# Altium project Keyboard.PrjPcb
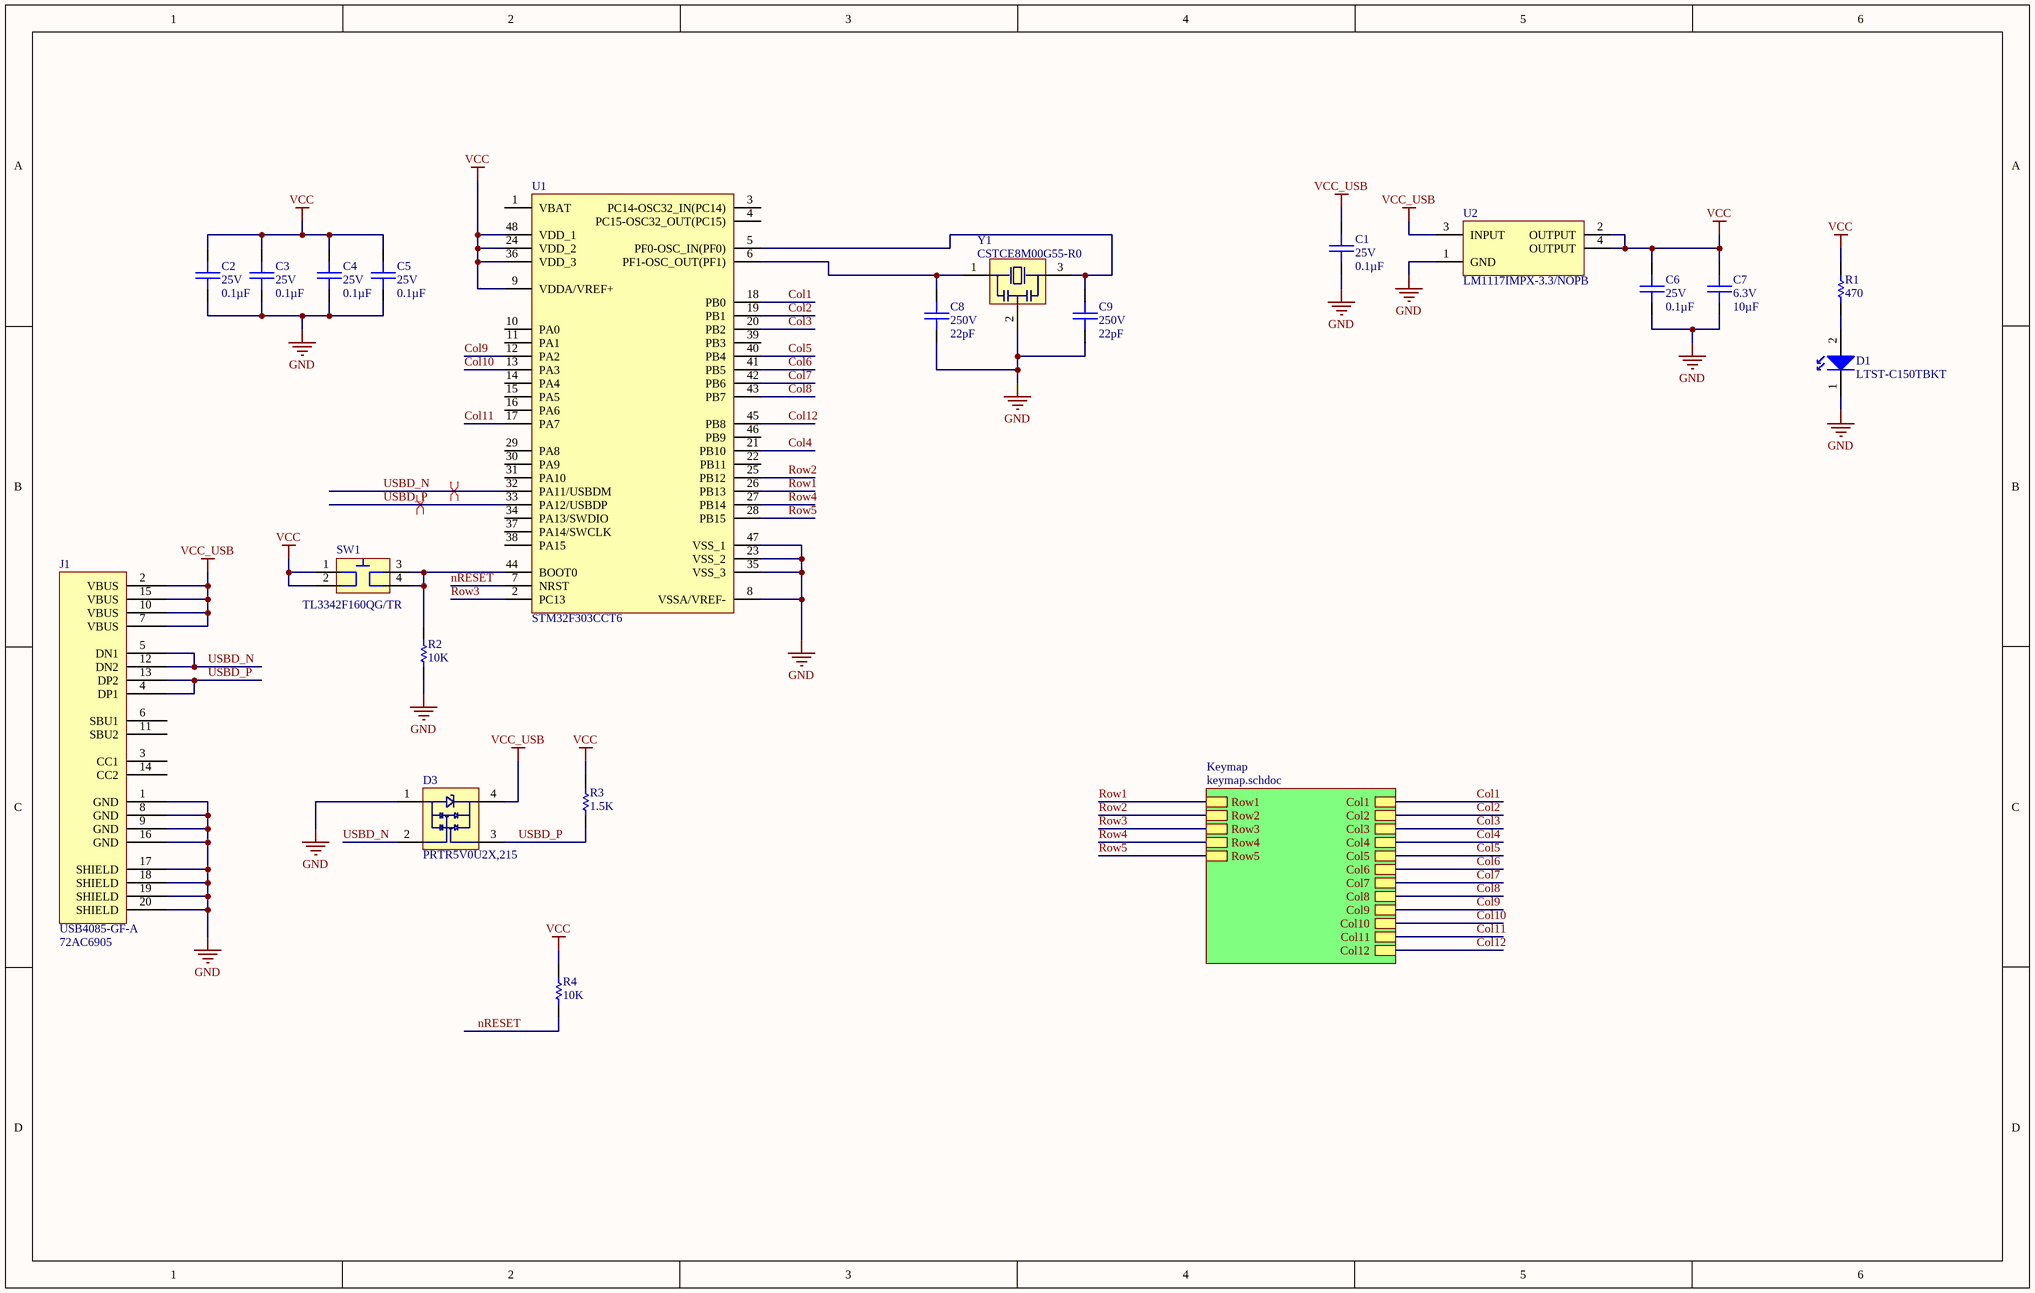
[diagram p0: Sheet1.SchDoc]
3 sheets, 140 parts. Net scope: hierarchical (ports join the sheet entries above them; power ports are global).
Board file: PCB1.PcbDoc
Sheets:
  Sheet1.SchDoc
    Keymap = Keymap.SchDoc
      K1 = key.SchDoc
      K2 = key.SchDoc
      K3 = key.SchDoc
      K4 = key.SchDoc
      K5 = key.SchDoc
      K6 = key.SchDoc
      K7 = key.SchDoc
      K8 = key.SchDoc
      K9 = key.SchDoc
      K10 = key.SchDoc
      K11 = key.SchDoc
      K12 = key.SchDoc
      K13 = key.SchDoc
      K14 = key.SchDoc
      K15 = key.SchDoc
      K16 = key.SchDoc
      K17 = key.SchDoc
      K18 = key.SchDoc
      K19 = key.SchDoc
      K20 = key.SchDoc
      K21 = key.SchDoc
      K22 = key.SchDoc
      K23 = key.SchDoc
      K24 = key.SchDoc
      K25 = key.SchDoc
      K26 = key.SchDoc
      K27 = key.SchDoc
      K28 = key.SchDoc
      K29 = key.SchDoc
      K30 = key.SchDoc
      K31 = key.SchDoc
      K32 = key.SchDoc
      K33 = key.SchDoc
      K34 = key.SchDoc
      K35 = key.SchDoc
      K36 = key.SchDoc
      K37 = key.SchDoc
      K38 = key.SchDoc
      K39 = key.SchDoc
      K40 = key.SchDoc
      K41 = key.SchDoc
      K42 = key.SchDoc
      K43 = key.SchDoc
      K44 = key.SchDoc
      K45 = key.SchDoc
      K46 = key.SchDoc
      K47 = key.SchDoc
      K48 = key.SchDoc
      K49 = key.SchDoc
      K50 = key.SchDoc
      K51 = key.SchDoc
      K52 = key.SchDoc
      K53 = key.SchDoc
      K54 = key.SchDoc
      K55 = key.SchDoc
      K56 = key.SchDoc
      K57 = key.SchDoc
      K58 = key.SchDoc
      K59 = key.SchDoc
      K60 = key.SchDoc

## Sheet Sheet1.SchDoc
size B; DocumentNumber: 1; SheetNumber: 1; SheetTotal: 3

### Parts
C1  value 0.1µF  Voltage: 25V  [CAPC_0603(1.6X0.8)_N]  (hidden comment: Generic CAPC 0603 0.1µF 25V ±10% X7R)
C2  value 0.1µF  Voltage: 25V  [CAPC_0603(1.6X0.8)_N]  (hidden comment: Generic CAPC 0603 0.1µF 25V ±10% X7R)
C3  value 0.1µF  Voltage: 25V  [CAPC_0603(1.6X0.8)_N]  (hidden comment: Generic CAPC 0603 0.1µF 25V ±10% X7R)
C4  value 0.1µF  Voltage: 25V  [CAPC_0603(1.6X0.8)_N]  (hidden comment: Generic CAPC 0603 0.1µF 25V ±10% X7R)
C5  value 0.1µF  Voltage: 25V  [CAPC_0603(1.6X0.8)_N]  (hidden comment: Generic CAPC 0603 0.1µF 25V ±10% X7R)
C6  value 0.1µF  Voltage: 25V  [CAPC_0603(1.6X0.8)_N]  (hidden comment: Generic CAPC 0603 0.1µF 25V ±10% X7R)
C7  value 10µF  Voltage: 6.3V  [CAPC_0603(1.6X0.8)_N]  (hidden comment: Generic CAPC 0603 10µF 6.3V ±20% X5R)
C8  value 22pF  Voltage: 250V  [CAPC_0603(1.6X0.8)_N]  (hidden comment: Generic CAPC 0603 22pF 250V ±2% C0G/NP0)
C9  value 22pF  Voltage: 250V  [CAPC_0603(1.6X0.8)_N]  (hidden comment: Generic CAPC 0603 22pF 250V ±2% C0G/NP0)
D1  LED 468NM BLUE CLEAR 1206 SMD  [LTST-C150TBKT_N]  (value not drawn)
D3  TVS DIODE 5.5VWM SOT143B  [NXP_SOT143B_N]  (value not drawn)
J1  USB4085-GF-A  Supplier Part Number 1: 72AC6905  [GCT_USB4085-GF-A_MN]
R1  value 470  [RESC_0603(1.6X0.8)_N]  (hidden comment: Generic RES 0603 470 0.1W 5%)
R2  value 10K  [RESC_0603(1.6X0.8)_N]  (hidden comment: Generic RES 0603 10K 0.1W 5%)
R3  value 1.5K  [RESC_0603(1.6X0.8)_N]  (hidden comment: Generic RES 0603 1.5K 0.1W 5%)
R4  value 10K  [RESC_0603(1.6X0.8)_N]  (hidden comment: Generic RES 0603 10K 0.1W 5%)
SW1  Manufacturer Part Number: TL3342F160QG/TR  [TL3342F160QG-TR]  (hidden comment: SWITCH TACTILE SPST-NO 0.05A 12V)
U1  32BIT, CORTEX-M4, 72MHZ, LQFP-48  [ST_LQFP-48-7x7x1.4_MN]  (value not drawn)
U2  Manufacturer Part Number: LM1117IMPX-3.3/NOPB  [TI_DCY-R-PDSO-G4_N]  (hidden comment: IC REG LDO 3.3V 0.8A SOT223)
Y1  CER RESONATOR 8.00MHZ SMD  [CSTCE8M00G55-R0]  (value not drawn)

### Sub-sheets
Keymap = keymap.schdoc: Col3, Col7, Col10, Col1, Col9, Col11, Row5, Col2, Col4, Col12, Col5, Col6, Row1, Row3, Row2, Row4, Col8

### Nets
GND: C1.2 C2.2 C3.2 C4.2 C5.2 C6.2 C7.2 C8.2 C9.2 D1.1(K) D3.1(GND) J1.1(GND) J1.8(GND) J1.9(GND) J1.16(GND) J1.17(SHIELD) J1.18(SHIELD) J1.19(SHIELD) J1.20(SHIELD) R2.1 U1.8(VSSA/VREF-) U1.23(VSS_2) U1.35(VSS_3) U1.47(VSS_1) U2.1(GND) Y1.2
VCC: C2.1 C3.1 C4.1 C5.1 C6.1 C7.1 R1.2 R3.2 R4.2 SW1.1 SW1.2 U1.9(VDDA/VREF+) U1.24(VDD_2) U1.36(VDD_3) U1.48(VDD_1) U2.2(OUTPUT) U2.4(OUTPUT)
VCC_USB: C1.1 D3.4(VCC) J1.2(VBUS) J1.7(VBUS) J1.10(VBUS) J1.15(VBUS) U2.3(INPUT)
Col1: U1.18(PB0) ; sheet Keymap/Col1
Col2: U1.19(PB1) ; sheet Keymap/Col2
Col3: U1.20(PB2) ; sheet Keymap/Col3
Col4: U1.21(PB10) ; sheet Keymap/Col4
Col5: U1.40(PB4) ; sheet Keymap/Col5
Col6: U1.41(PB5) ; sheet Keymap/Col6
Col7: U1.42(PB6) ; sheet Keymap/Col7
Col8: U1.43(PB7) ; sheet Keymap/Col8
Col9: U1.12(PA2) ; sheet Keymap/Col9
Col10: U1.13(PA3) ; sheet Keymap/Col10
Col11: U1.17(PA7) ; sheet Keymap/Col11
Col12: U1.45(PB8) ; sheet Keymap/Col12
nRESET: R4.1 U1.7(NRST)
Row1: U1.26(PB13) ; sheet Keymap/Row1
Row2: U1.25(PB12) ; sheet Keymap/Row2
Row3: U1.2(PC13) ; sheet Keymap/Row3
Row4: U1.27(PB14) ; sheet Keymap/Row4
Row5: U1.28(PB15) ; sheet Keymap/Row5
USBD_N: D3.2(IO1) J1.5(DN1) J1.12(DN2) U1.32(PA11/USBDM)
USBD_P: D3.3(IO2) J1.4(DP1) J1.13(DP2) R3.1 U1.33(PA12/USBDP)
NetC8_1: C8.1 U1.6(PF1-OSC_OUT(PF1)) Y1.1
NetC9_1: C9.1 U1.5(PF0-OSC_IN(PF0)) Y1.3
NetD1_2: D1.2(A) R1.1
NetR2_2: R2.2 SW1.3 SW1.4 U1.44(BOOT0)

Not connected (* = marked no-connect by the designer): J1 3(CC1) 6(SBU1) 11(SBU2) 14(CC2); U1 1(VBAT) 3(PC14-OSC32_IN(PC14)) 4(PC15-OSC32_OUT(PC15)) 10(PA0) 11(PA1) 14(PA4) 15(PA5) 16(PA6) 22(PB11) 29(PA8) 30(PA9) 31(PA10) 34(PA13/SWDIO) 37(PA14/SWCLK) 38(PA15) 39(PB3) 46(PB9)

### Layout directives
differential pair: USBD_N, USBD_P

### Library data of the parts
C1-C6 = SFE-CAPC-0603-0.1µF-25V-±10%-X7R: Generic Capacitor; Case-IEC: 0603; capacitance: 0.0000001; Case-Metric: *; Tolerance: ±10%; DesignID: SFE-CAPC-0603-0.1µF-25V-±10%-X7R; Manufacturer: Generic; Manufacturer Part Number: SFE-CAPC-0603-0.1µF-25V-±10%-X7R
C7 = SFE-CAPC-0603-10µF-6.3V-±20%-X5R: Generic Capacitor; Case-IEC: 0603; capacitance: 0.00001; Case-Metric: *; Tolerance: ±20%; DesignID: SFE-CAPC-0603-10µF-6.3V-±20%-X5R; Manufacturer: Generic; Manufacturer Part Number: SFE-CAPC-0603-10µF-6.3V-±20%-X5R
C8 C9 = SFE-CAPC-0603-22pF-250V-±2%-C0G/NP0: Generic Capacitor; Case-IEC: 0603; capacitance: 0.000000000022; Case-Metric: *; Tolerance: ±2%; DesignID: SFE-CAPC-0603-22pF-250V-±2%-C0G/NP0; Manufacturer: Generic; Manufacturer Part Number: SFE-CAPC-0603-22pF-250V-±2%-C0G/NP0
D1 = LTST-C150TBKT: Manufacturer: Lite-On Inc; SafariPartNumber: 15 25012RC; Wavelength - Dominant: 470nm; Millicandela Rating: 104mcd; Voltage - Forward (Vf) (Typ): 3.3V; Current - Test: 20mA; Viewing Angle: 130°; Lens Style/Size: Rectangle with Flat Top, 2.06mm x 1.6mm; Supplier 1: Digi-Key; Supplier Part Number 1: 160-1643-1-ND; RoHS: RoHS Compliant; Category: Optoelectronics; Stock 1: 267579; Pricing 1: 1=0.5, 10=0.369, 100=0.1956, 250=0.13836, 500=0.11808, 1000=0.09225 (USD); Packaging: Cut Tape (CT); Color: Blue; Wavelength - Peak: 468nm; Lens Type: Clear; Package / Case: 1206 (3216 Metric); Size / Dimension: 3.20mm L x 1.60mm W; Height: 1.10mm; Mounting Type: Surface Mount; Luminous Flux @ Current - Test: -; ComponentLink1URL: http://optoelectronics.liteon.com/upload/download/DS22-2000-026/S_110_LTST-C150TBKT(0630).pdf; ComponentLink1Description: http://optoelectronics.liteon.com/upload/download/DS22-2000-026/S_110_LTST-C150TBKT(0630).pdf; Manufacturer Part Number: LTST-C150TBKT; DesignID: LTST-C150TBKT
D3 = PRTR5V0U2X,215: Manufacturer: NXP Semiconductors; SafariPartNumber: 15 27314RC; Type: Steering (Rail to Rail); Bidirectional Channels: 2; Voltage - Reverse Standoff (Typ): 5.5V (Max); Voltage - Breakdown (Min): 6V; Power Line Protection: Yes; Capacitance @ Frequency: 1pF @ 1MHz; Supplier 1: Digi-Key; Supplier Part Number 1: 568-4140-1-ND; RoHS: RoHS Compliant; Category: Circuit Protection; Stock 1: 19762; Pricing 1: 1=0.57, 10=0.477, 25=0.418, 100=0.3578, 250=0.31036, 500=0.26286, 1000=0.20265 (USD); Packaging: Cut Tape (CT); Unidirectional Channels: -; Voltage - Clamping (Max) @ Ipp: -; Current - Peak Pulse (10/1000µs): -; Power - Peak Pulse: -; Applications: General Purpose; Operating Temperature: -40°C ~ 85°C (TA); Mounting Type: Surface Mount; Package / Case: TO-253-4, TO-253AA; Supplier Device Package: SOT-143B; ComponentLink1URL: https://assets.nexperia.com/documents/data-sheet/PRTR5V0U2X.pdf; ComponentLink1Description: Datasheet; Manufacturer Part Number: PRTR5V0U2X,215; DesignID: PRTR5V0U2X,215
J1 = USB4085-GF-A: USB4085 Series 20 V PCB Top Mount USB 2.0 Type C Receptacle; Manufacturer 1: Global Connector Technology; USB Standard: USB 2.0; Number of Positions: 16; Supplier 1: Newark; Manufacturer Part Number 1: USB4085-GF-A; RoHS: No; Pricing 1: 1=1.38000, 10=1.23000, 25=1.15000, 50=1.06000, 100=0.91100, 250=0.83700, 700=0.77300, 1400=0.72600 (USD); Contact Material: Copper Alloy; Contact Plating: Gold; Gender: Receptacle; Orientation: Right Angle; ComponentLink1URL: https://datasheet.ciiva.com/71788/2674755-71788146.pdf?src-supplier=Element14; ComponentLink1Description: https://datasheet.ciiva.com/71788/2674755-71788146.pdf?src-supplier=Element14; ComponentLink2URL: https://datasheet.ciiva.com/71788/usb4085-71788147.pdf?src-supplier=Digi-Key; ComponentLink2Description: https://datasheet.ciiva.com/71788/usb4085-71788147.pdf?src-supplier=Digi-Key
R1 = SFE-RES-0603-470-0.1W-5%: Generic Resistor; Temperature Coefficient: PPM; Case-IEC: 0603; ValueString: 4705%; Tolerance: 5%; Power: 0.1W; DesignID: SFE-RES-0603-470-0.1W-5%; Manufacturer: Generic; Manufacturer Part Number: SFE-RES-0603-470-0.1W-5%; Resistance: 470
R2 R4 = SFE-RES-0603-10K-0.1W-5%: Generic Resistor; Temperature Coefficient: PPM; Case-IEC: 0603; ValueString: 10K5%; Resistance: 10000; Tolerance: 5%; Power: 0.1W; DesignID: SFE-RES-0603-10K-0.1W-5%; Manufacturer: Generic; Manufacturer Part Number: SFE-RES-0603-10K-0.1W-5%
R3 = SFE-RES-0603-1.5K-0.1W-5%: Generic Resistor; Temperature Coefficient: PPM; Case-IEC: 0603; ValueString: 1.5K5%; Resistance: 1500; Tolerance: 5%; Power: 0.1W; DesignID: SFE-RES-0603-1.5K-0.1W-5%; Manufacturer: Generic; Manufacturer Part Number: SFE-RES-0603-1.5K-0.1W-5%
SW1 = TL3342F160QG/TR: Manufacturer: E-Switch; Switch Function: Off-Mom; Contact Rating @ Voltage: 0.05A @ 12VDC; Actuator Type: Standard; Actuator Height off PCB, from Pins: 1.54mm; Actuator Orientation: Top Actuated; Outline: 4.90mm x 4.90mm; Illumination: Non-Illuminated; Operating Force: 160gf; Actuator Material: Polyphenylene Sulfide (PPS); Mechanical Life: 100,000 Cycles; Supplier 1: Digi-Key; Supplier Part Number 1: EG2531CT-ND; RoHS: RoHS Compliant; Category: Switches; Stock 1: 54320; Pricing 1: 1=0.63, 10=0.603, 25=0.5916, 50=0.5694, 100=0.4913, 250=0.4466, 500=0.42428, 1000=0.33495 (USD); Packaging: Cut Tape (CT); Circuit: SPST-NO; Mounting Type: Surface Mount; Termination Style: Gull Wing; Illumination Voltage (Nominal): -; Illumination Type, Color: -; Ingress Protection: -; Features: -; Switch Travel: -; Operating Temperature: -; ComponentLink1URL: https://www.e-switch.com/system/asset/product_line/data_sheet/165/TL3342.pdf; ComponentLink1Description: https://www.e-switch.com/system/asset/product_line/data_sheet/165/TL3342.pdf; DesignID: TL3342F160QG/TR
U1 = STM32F303CCT6: Manufacturer 1: STMicroelectronics; Manufacturer: ST Micro; Number of I/Os: 37; Interface: I2C,SPI,USB,CAN,IrDA,UART,USART,LIN,I2S; RAM Size: 40KB; Number of Timers/Counters: 10; Oscillator Type: Internal; Number of Programmable I/O: 27; Data Bus Width: 32b; Watchdog Timer: Yes; Memory Type: FLASH; Memory Size: 256KB; Peripherals: POR,PWM,WDT,DMA; Core Architecture: ARM; Max Supply Voltage: 3.6V; Min Supply Voltage: 2V; Number of ADC Channels: 39; Number of SPI Channels: 3; Number of I2C Channels: 2; Number of USB Channels: 1; Supplier 1: Digi-Key; Stock 1: 5656; Pricing 1: 1=5.94000, 10=5.33600, 100=4.37190, 500=3.72172, 1000=3.13880 (USD); RoHS: Yes; Case/Package: LQFP; Number of Pins: 48; Contact Plating: Gold; Min Operating Temperature: -40°C; Max Operating Temperature: 85°C; Frequency: 72MHz; Packaging: Tray; Max Frequency: 72MHz; Package Quantity: 250; Length: 10mm; Height: 1.45mm; Width: 7.2mm; Radiation Hardening: No; Lead Free: Lead Free; REACH SVHC: No SVHC; ComponentLink1URL: https://datasheet.ciiva.com/14666/0900766b81171360-14666656.pdf?src-supplier=RSComponents; ComponentLink1Description: https://datasheet.ciiva.com/14666/0900766b81171360-14666656.pdf?src-supplier=RSComponents; ComponentLink2URL: https://datasheet.ciiva.com/8055/1831499-8055015.pdf?src-supplier=Element14; ComponentLink2Description: https://datasheet.ciiva.com/8055/1831499-8055015.pdf?src-supplier=Element14; Supplier Part Number 1: 497-13318-ND; Manufacturer Part Number 1: STM32F303CCT6; DesignID: STM32F303CCT6; Manufacturer Part Number: STM32F303CCT6
U2 = LM1117IMPX-3.3/NOPB: Manufacturer: Texas Instruments; SafariPartNumber: 15 24656RC; Regulator Topology: Positive Fixed; Current - Output: 800mA; Voltage - Dropout (Typical): 1.2V @ 800mA; Number of Regulators: 1; Voltage - Input: Up to 15V; Supplier 1: Digi-Key; Supplier Part Number 1: LM1117IMPX-3.3/NOPBCT-ND; RoHS: RoHS Compliant; Category: Integrated Circuits (ICs); Stock 1: 19906; Pricing 1: 1=1.04, 10=0.927, 100=0.7229, 500=0.5978, 1000=0.47275 (USD); Packaging: Cut Tape (CT); Voltage - Output: 3.3V; Current - Limit (Min): 800mA; Operating Temperature: -40°C ~ 125°C; Mounting Type: Surface Mount; Package / Case: TO-261-4, TO-261AA; Supplier Device Package: SOT-223-4; ComponentLink1URL: http://www.ti.com/lit/ds/symlink/lm1117.pdf; ComponentLink1Description: http://www.ti.com/lit/ds/symlink/lm1117.pdf; Supplier 2: Mouser; Supplier Part Number 2: 926-LM1117IMPX33NOPB; Supplier 3: Newark; Supplier Part Number 3: 28X3413; DesignID: LM1117IMPX-3.3/NOPB
Y1 = CSTCE8M00G55-R0: Manufacturer: Murata Electronics North America; Frequency: 8MHz; Frequency Stability: ±0.2%; Frequency Tolerance: ±0.5%; Capacitance: 33pF; Supplier 1: Digi-Key; Supplier Part Number 1: 490-1195-1-ND; RoHS: RoHS Compliant; Category: Crystals and Oscillators; Stock 1: 11412; Pricing 1: 1=0.46, 10=0.384, 50=0.3456, 100=0.3074, 500=0.29134, 1000=0.24595 (USD); Packaging: Cut Tape (CT); Type: Ceramic; Features: Built in Capacitor; Impedance: -; Operating Temperature: -20°C ~ 80°C; Mounting Type: Surface Mount; Package / Case: 3-SMD, Non-Standard; Size / Dimension: 0.126" L x 0.051" W (3.20mm x 1.30mm); Height: 0.031" (0.80mm); ComponentLink1URL: http://www.murata.com/~/media/webrenewal/support/library/catalog/products/timingdevice/ceralock/p16e.ashx; ComponentLink1Description: http://www.murata.com/~/media/webrenewal/support/library/catalog/products/timingdevice/ceralock/p16e.ashx; Manufacturer Part Number: CSTCE8M00G55-R0; DesignID: CSTCE8M00G55-R0

## Sheet Keymap.SchDoc
size B; DocumentNumber: 2; SheetNumber: 2; SheetTotal: 3
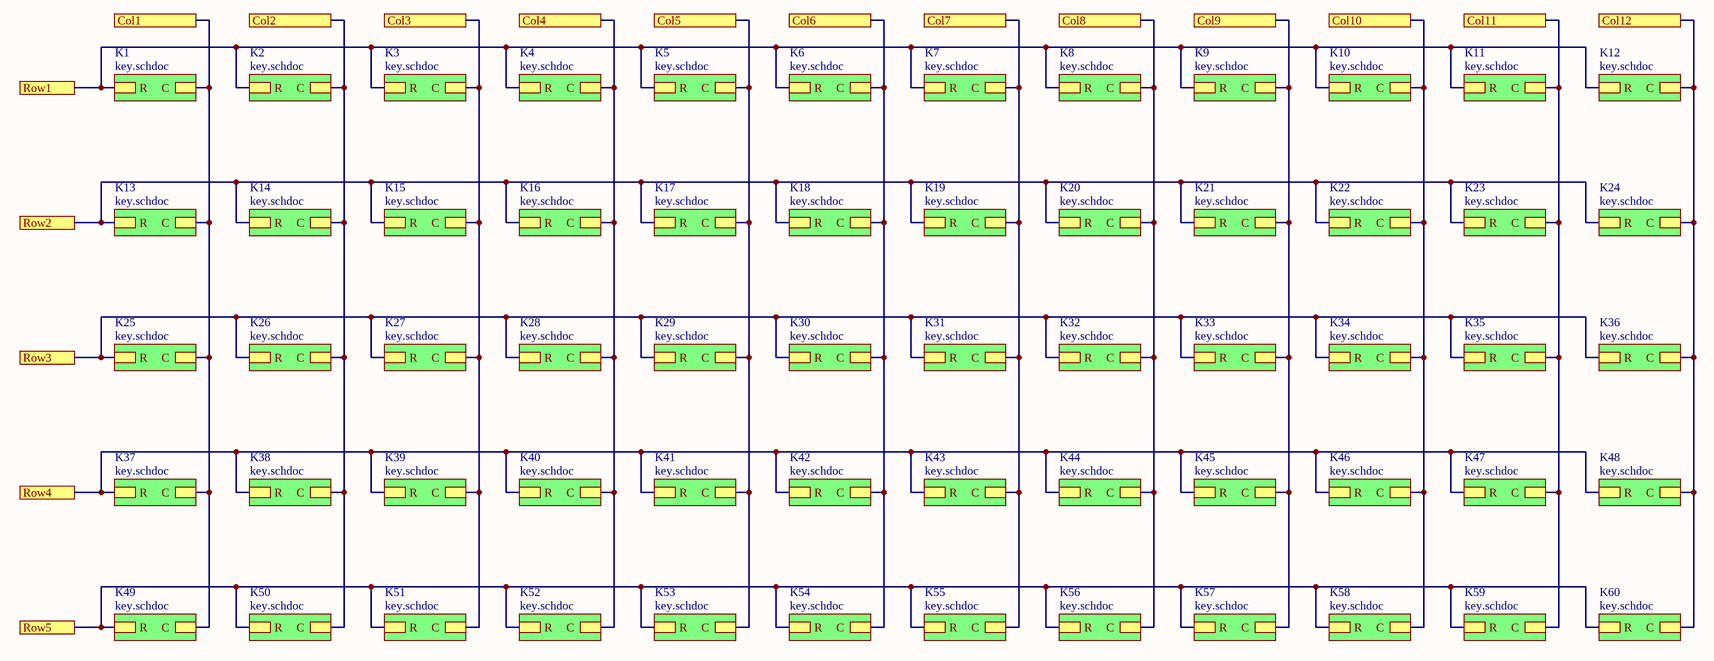
[diagram p1: Keymap.SchDoc]

### Sub-sheets
K1 = key.schdoc: R, C
K2 = key.schdoc: R, C
K3 = key.schdoc: R, C
K4 = key.schdoc: R, C
K5 = key.schdoc: R, C
K6 = key.schdoc: R, C
K7 = key.schdoc: R, C
K8 = key.schdoc: R, C
K9 = key.schdoc: R, C
K10 = key.schdoc: R, C
K11 = key.schdoc: R, C
K12 = key.schdoc: R, C
K13 = key.schdoc: R, C
K14 = key.schdoc: R, C
K15 = key.schdoc: R, C
K16 = key.schdoc: R, C
K17 = key.schdoc: R, C
K18 = key.schdoc: R, C
K19 = key.schdoc: R, C
K20 = key.schdoc: R, C
K21 = key.schdoc: R, C
K22 = key.schdoc: R, C
K23 = key.schdoc: R, C
K24 = key.schdoc: R, C
K25 = key.schdoc: R, C
K26 = key.schdoc: R, C
K27 = key.schdoc: R, C
K28 = key.schdoc: R, C
K29 = key.schdoc: R, C
K30 = key.schdoc: R, C
K31 = key.schdoc: R, C
K32 = key.schdoc: R, C
K33 = key.schdoc: R, C
K34 = key.schdoc: R, C
K35 = key.schdoc: R, C
K36 = key.schdoc: R, C
K37 = key.schdoc: R, C
K38 = key.schdoc: R, C
K39 = key.schdoc: R, C
K40 = key.schdoc: R, C
K41 = key.schdoc: R, C
K42 = key.schdoc: R, C
K43 = key.schdoc: R, C
K44 = key.schdoc: R, C
K45 = key.schdoc: R, C
K46 = key.schdoc: R, C
K47 = key.schdoc: R, C
K48 = key.schdoc: R, C
K49 = key.schdoc: R, C
K50 = key.schdoc: R, C
K51 = key.schdoc: R, C
K52 = key.schdoc: R, C
K53 = key.schdoc: R, C
K54 = key.schdoc: R, C
K55 = key.schdoc: R, C
K56 = key.schdoc: R, C
K57 = key.schdoc: R, C
K58 = key.schdoc: R, C
K59 = key.schdoc: R, C
K60 = key.schdoc: R, C

### Ports
Col1, Col2, Col3, Col4, Col5, Col6, Col7, Col8, Col9, Col10, Col11, Col12, Row1, Row2, Row3, Row4, Row5

### Nets
Col1: port Col1, sheet K1/C, sheet K13/C, sheet K25/C, sheet K37/C, sheet K49/C
Col2: port Col2, sheet K2/C, sheet K14/C, sheet K26/C, sheet K38/C, sheet K50/C
Col3: port Col3, sheet K3/C, sheet K15/C, sheet K27/C, sheet K39/C, sheet K51/C
Col4: port Col4, sheet K4/C, sheet K16/C, sheet K28/C, sheet K40/C, sheet K52/C
Col5: port Col5, sheet K5/C, sheet K17/C, sheet K29/C, sheet K41/C, sheet K53/C
Col6: port Col6, sheet K6/C, sheet K18/C, sheet K30/C, sheet K42/C, sheet K54/C
Col7: port Col7, sheet K7/C, sheet K19/C, sheet K31/C, sheet K43/C, sheet K55/C
Col8: port Col8, sheet K8/C, sheet K20/C, sheet K32/C, sheet K44/C, sheet K56/C
Col9: port Col9, sheet K9/C, sheet K21/C, sheet K33/C, sheet K45/C, sheet K57/C
Col10: port Col10, sheet K10/C, sheet K22/C, sheet K34/C, sheet K46/C, sheet K58/C
Col11: port Col11, sheet K11/C, sheet K23/C, sheet K35/C, sheet K47/C, sheet K59/C
Col12: port Col12, sheet K12/C, sheet K24/C, sheet K36/C, sheet K48/C, sheet K60/C
Row1: port Row1, sheet K1/R, sheet K2/R, sheet K3/R, sheet K4/R, sheet K5/R, sheet K6/R, sheet K7/R, sheet K8/R, sheet K9/R, sheet K10/R, sheet K11/R, sheet K12/R
Row2: port Row2, sheet K13/R, sheet K14/R, sheet K15/R, sheet K16/R, sheet K17/R, sheet K18/R, sheet K19/R, sheet K20/R, sheet K21/R, sheet K22/R, sheet K23/R, sheet K24/R
Row3: port Row3, sheet K25/R, sheet K26/R, sheet K27/R, sheet K28/R, sheet K29/R, sheet K30/R, sheet K31/R, sheet K32/R, sheet K33/R, sheet K34/R, sheet K35/R, sheet K36/R
Row4: port Row4, sheet K37/R, sheet K38/R, sheet K39/R, sheet K40/R, sheet K41/R, sheet K42/R, sheet K43/R, sheet K44/R, sheet K45/R, sheet K46/R, sheet K47/R, sheet K48/R
Row5: port Row5, sheet K49/R, sheet K50/R, sheet K51/R, sheet K52/R, sheet K53/R, sheet K54/R, sheet K55/R, sheet K56/R, sheet K57/R, sheet K58/R, sheet K59/R, sheet K60/R

## Sheet key.SchDoc
size B; DocumentNumber: 3; SheetNumber: 3; SheetTotal: 3
Used 60 times, as channels Keymap/K1, Keymap/K2, Keymap/K3, Keymap/K4, Keymap/K5, Keymap/K6, Keymap/K7, Keymap/K8, Keymap/K9, Keymap/K10, Keymap/K11, Keymap/K12, Keymap/K13, Keymap/K14, Keymap/K15, Keymap/K16, Keymap/K17, Keymap/K18, Keymap/K19, Keymap/K20, Keymap/K21, Keymap/K22, Keymap/K23, Keymap/K24, Keymap/K25, Keymap/K26, Keymap/K27, Keymap/K28, Keymap/K29, Keymap/K30, Keymap/K31, Keymap/K32, Keymap/K33, Keymap/K34, Keymap/K35, Keymap/K36, Keymap/K37, Keymap/K38, Keymap/K39, Keymap/K40, Keymap/K41, Keymap/K42, Keymap/K43, Keymap/K44, Keymap/K45, Keymap/K46, Keymap/K47, Keymap/K48, Keymap/K49, Keymap/K50, Keymap/K51, Keymap/K52, Keymap/K53, Keymap/K54, Keymap/K55, Keymap/K56, Keymap/K57, Keymap/K58, Keymap/K59, Keymap/K60. Parts and nets are listed once, with the designators drawn on the sheet.
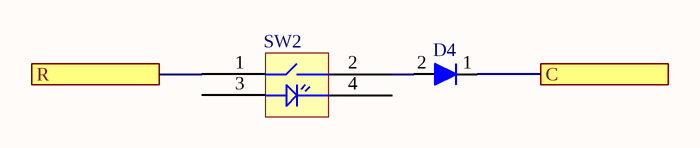
[diagram p2: key.SchDoc]

### Parts
D4  DIODE GEN PURP 100V 300MA SOD123  [1N4148W-7-F_N]  (value not drawn)
SW2  MX1A-E1NW  [CHRY_MXXX-XXXW_No_LED_MA]  (value not drawn)

### Ports
C, R

### Nets
C: D4.1(K) ; port C
R: SW2.1 ; port R
NetD4_2: D4.2(A) SW2.2

Not connected (* = marked no-connect by the designer): SW2 3 4

### Channels
Keymap/K1: designators end in _K1; ports C=Col1 R=Row1
Keymap/K2: designators end in _K2; ports C=Col2 R=Row1
Keymap/K3: designators end in _K3; ports C=Col3 R=Row1
Keymap/K4: designators end in _K4; ports C=Col4 R=Row1
Keymap/K5: designators end in _K5; ports C=Col5 R=Row1
Keymap/K6: designators end in _K6; ports C=Col6 R=Row1
Keymap/K7: designators end in _K7; ports C=Col7 R=Row1
Keymap/K8: designators end in _K8; ports C=Col8 R=Row1
Keymap/K9: designators end in _K9; ports C=Col9 R=Row1
Keymap/K10: designators end in _K10; ports C=Col10 R=Row1
Keymap/K11: designators end in _K11; ports C=Col11 R=Row1
Keymap/K12: designators end in _K12; ports C=Col12 R=Row1
Keymap/K13: designators end in _K13; ports C=Col1 R=Row2
Keymap/K14: designators end in _K14; ports C=Col2 R=Row2
Keymap/K15: designators end in _K15; ports C=Col3 R=Row2
Keymap/K16: designators end in _K16; ports C=Col4 R=Row2
Keymap/K17: designators end in _K17; ports C=Col5 R=Row2
Keymap/K18: designators end in _K18; ports C=Col6 R=Row2
Keymap/K19: designators end in _K19; ports C=Col7 R=Row2
Keymap/K20: designators end in _K20; ports C=Col8 R=Row2
Keymap/K21: designators end in _K21; ports C=Col9 R=Row2
Keymap/K22: designators end in _K22; ports C=Col10 R=Row2
Keymap/K23: designators end in _K23; ports C=Col11 R=Row2
Keymap/K24: designators end in _K24; ports C=Col12 R=Row2
Keymap/K25: designators end in _K25; ports C=Col1 R=Row3
Keymap/K26: designators end in _K26; ports C=Col2 R=Row3
Keymap/K27: designators end in _K27; ports C=Col3 R=Row3
Keymap/K28: designators end in _K28; ports C=Col4 R=Row3
Keymap/K29: designators end in _K29; ports C=Col5 R=Row3
Keymap/K30: designators end in _K30; ports C=Col6 R=Row3
Keymap/K31: designators end in _K31; ports C=Col7 R=Row3
Keymap/K32: designators end in _K32; ports C=Col8 R=Row3
Keymap/K33: designators end in _K33; ports C=Col9 R=Row3
Keymap/K34: designators end in _K34; ports C=Col10 R=Row3
Keymap/K35: designators end in _K35; ports C=Col11 R=Row3
Keymap/K36: designators end in _K36; ports C=Col12 R=Row3
Keymap/K37: designators end in _K37; ports C=Col1 R=Row4
Keymap/K38: designators end in _K38; ports C=Col2 R=Row4
Keymap/K39: designators end in _K39; ports C=Col3 R=Row4
Keymap/K40: designators end in _K40; ports C=Col4 R=Row4
Keymap/K41: designators end in _K41; ports C=Col5 R=Row4
Keymap/K42: designators end in _K42; ports C=Col6 R=Row4
Keymap/K43: designators end in _K43; ports C=Col7 R=Row4
Keymap/K44: designators end in _K44; ports C=Col8 R=Row4
Keymap/K45: designators end in _K45; ports C=Col9 R=Row4
Keymap/K46: designators end in _K46; ports C=Col10 R=Row4
Keymap/K47: designators end in _K47; ports C=Col11 R=Row4
Keymap/K48: designators end in _K48; ports C=Col12 R=Row4
Keymap/K49: designators end in _K49; ports C=Col1 R=Row5
Keymap/K50: designators end in _K50; ports C=Col2 R=Row5
Keymap/K51: designators end in _K51; ports C=Col3 R=Row5
Keymap/K52: designators end in _K52; ports C=Col4 R=Row5
Keymap/K53: designators end in _K53; ports C=Col5 R=Row5
Keymap/K54: designators end in _K54; ports C=Col6 R=Row5
Keymap/K55: designators end in _K55; ports C=Col7 R=Row5
Keymap/K56: designators end in _K56; ports C=Col8 R=Row5
Keymap/K57: designators end in _K57; ports C=Col9 R=Row5
Keymap/K58: designators end in _K58; ports C=Col10 R=Row5
Keymap/K59: designators end in _K59; ports C=Col11 R=Row5
Keymap/K60: designators end in _K60; ports C=Col12 R=Row5

### Library data of the parts
D4 = 1N4148W-7-F: Manufacturer: Diodes Incorporated; SafariPartNumber: 15 15821RC; Diode Type: Standard; Current - Average Rectified (Io): 300mA (DC); Voltage - Forward (Vf) (Max) @ If: 1.25V @ 150mA; Speed: Small Signal =< 200mA (Io), Any Speed; Reverse Recovery Time (trr): 4ns; Current - Reverse Leakage @ Vr: 1µA @ 75V; Capacitance @ Vr, F: 2pF @ 0V, 1MHz; Supplier 1: Digi-Key; Supplier Part Number 1: 1N4148W-FDICT-ND; RoHS: RoHS Compliant; Category: Discrete Semiconductor Products; Stock 1: 649808; Pricing 1: 1=0.16, 10=0.149, 100=0.081, 500=0.04986, 1000=0.03399 (USD); Packaging: Cut Tape (CT); Part Status: Active; Voltage - DC Reverse (Vr) (Max): 100V; Mounting Type: Surface Mount; Package / Case: SOD-123; Supplier Device Package: SOD-123; Operating Temperature - Junction: -65°C ~ 150°C; ComponentLink1URL: http://www.diodes.com/_files/datasheets/ds30086.pdf; ComponentLink1Description: http://www.diodes.com/_files/datasheets/ds30086.pdf; Manufacturer Part Number: 1N4148W-7-F; DesignID: 1N4148W-7-F
SW2 = MX1A-E1NW: SWITCH PUSH SPST-NO 0.01A 12V; Manufacturer 1: Cherry; Mechanical Life: 20000000Cycles; Throw Configuration: SPST; Current Rating: 10mA; Contact Resistance: 200mR; Operating Force: 0.5N; Switch Function: Off-Mom; Row Spacing: 2.54mm; Actuator Length: 3.6mm; Supplier 1: Digi-Key; Stock 1: 7477; Pricing 1: 1=0.90000, 10=0.84000, 25=0.80000, 50=0.76000, 100=0.74000, 250=0.72000, 500=0.68000, 1000=0.64000, 5000=0.54000 (USD); RoHS: Yes; Mount: Through Hole; Contact Plating: Gold; Contact Material: Gold,Silver; Number of Terminals: 2; Housing Material: Thermoplastic; Min Operating Temperature: -10°C; Max Operating Temperature: 70°C; Voltage Rating (AC): 12V; Voltage Rating (DC): 12V; Packaging: Bulk; Max Voltage Rating (AC): 12V; Max Voltage Rating (DC): 12V; Max Current Rating: 10mA; Package Quantity: 1000; Termination: PC Pin; Electrical Life: 20000000Cycles; Orientation: Straight; Contact Current Rating: 10mA; Length: 15.6mm; Terminal Pitch: 6.35mm; Width: 15.6mm; Lead Free: Lead Free; Flammability Rating: UL94 HB; ComponentLink1URL: https://datasheet.ciiva.com/2869/mx20series-2869568.pdf?src-supplier=Digi-Key; ComponentLink1Description: https://datasheet.ciiva.com/2869/mx20series-2869568.pdf?src-supplier=Digi-Key; ComponentLink2URL: https://datasheet.ciiva.com/5259/mx-cat-216303-5259204.pdf?src-supplier=Mouser; ComponentLink2Description: https://datasheet.ciiva.com/5259/mx-cat-216303-5259204.pdf?src-supplier=Mouser; Supplier Part Number 1: CH197-ND; Manufacturer Part Number 1: MX1A-E1NW

## Nets that join several sheets
Col1: Sheet1 (U1.18), Keymap/K1 (D4_K1.1), Keymap/K13 (D4_K13.1), Keymap/K25 (D4_K25.1), Keymap/K37 (D4_K37.1), Keymap/K49 (D4_K49.1)
Col2: Sheet1 (U1.19), Keymap/K2 (D4_K2.1), Keymap/K14 (D4_K14.1), Keymap/K26 (D4_K26.1), Keymap/K38 (D4_K38.1), Keymap/K50 (D4_K50.1)
Col3: Sheet1 (U1.20), Keymap/K3 (D4_K3.1), Keymap/K15 (D4_K15.1), Keymap/K27 (D4_K27.1), Keymap/K39 (D4_K39.1), Keymap/K51 (D4_K51.1)
Col4: Sheet1 (U1.21), Keymap/K4 (D4_K4.1), Keymap/K16 (D4_K16.1), Keymap/K28 (D4_K28.1), Keymap/K40 (D4_K40.1), Keymap/K52 (D4_K52.1)
Col5: Sheet1 (U1.40), Keymap/K5 (D4_K5.1), Keymap/K17 (D4_K17.1), Keymap/K29 (D4_K29.1), Keymap/K41 (D4_K41.1), Keymap/K53 (D4_K53.1)
Col6: Sheet1 (U1.41), Keymap/K6 (D4_K6.1), Keymap/K18 (D4_K18.1), Keymap/K30 (D4_K30.1), Keymap/K42 (D4_K42.1), Keymap/K54 (D4_K54.1)
Col7: Sheet1 (U1.42), Keymap/K7 (D4_K7.1), Keymap/K19 (D4_K19.1), Keymap/K31 (D4_K31.1), Keymap/K43 (D4_K43.1), Keymap/K55 (D4_K55.1)
Col8: Sheet1 (U1.43), Keymap/K8 (D4_K8.1), Keymap/K20 (D4_K20.1), Keymap/K32 (D4_K32.1), Keymap/K44 (D4_K44.1), Keymap/K56 (D4_K56.1)
Col9: Sheet1 (U1.12), Keymap/K9 (D4_K9.1), Keymap/K21 (D4_K21.1), Keymap/K33 (D4_K33.1), Keymap/K45 (D4_K45.1), Keymap/K57 (D4_K57.1)
Col10: Sheet1 (U1.13), Keymap/K10 (D4_K10.1), Keymap/K22 (D4_K22.1), Keymap/K34 (D4_K34.1), Keymap/K46 (D4_K46.1), Keymap/K58 (D4_K58.1)
Col11: Sheet1 (U1.17), Keymap/K11 (D4_K11.1), Keymap/K23 (D4_K23.1), Keymap/K35 (D4_K35.1), Keymap/K47 (D4_K47.1), Keymap/K59 (D4_K59.1)
Col12: Sheet1 (U1.45), Keymap/K12 (D4_K12.1), Keymap/K24 (D4_K24.1), Keymap/K36 (D4_K36.1), Keymap/K48 (D4_K48.1), Keymap/K60 (D4_K60.1)
Row1: Sheet1 (U1.26), Keymap/K1 (SW2_K1.1), Keymap/K2 (SW2_K2.1), Keymap/K3 (SW2_K3.1), Keymap/K4 (SW2_K4.1), Keymap/K5 (SW2_K5.1), Keymap/K6 (SW2_K6.1), Keymap/K7 (SW2_K7.1), Keymap/K8 (SW2_K8.1), Keymap/K9 (SW2_K9.1), Keymap/K10 (SW2_K10.1), Keymap/K11 (SW2_K11.1), Keymap/K12 (SW2_K12.1)
Row2: Sheet1 (U1.25), Keymap/K13 (SW2_K13.1), Keymap/K14 (SW2_K14.1), Keymap/K15 (SW2_K15.1), Keymap/K16 (SW2_K16.1), Keymap/K17 (SW2_K17.1), Keymap/K18 (SW2_K18.1), Keymap/K19 (SW2_K19.1), Keymap/K20 (SW2_K20.1), Keymap/K21 (SW2_K21.1), Keymap/K22 (SW2_K22.1), Keymap/K23 (SW2_K23.1), Keymap/K24 (SW2_K24.1)
Row3: Sheet1 (U1.2), Keymap/K25 (SW2_K25.1), Keymap/K26 (SW2_K26.1), Keymap/K27 (SW2_K27.1), Keymap/K28 (SW2_K28.1), Keymap/K29 (SW2_K29.1), Keymap/K30 (SW2_K30.1), Keymap/K31 (SW2_K31.1), Keymap/K32 (SW2_K32.1), Keymap/K33 (SW2_K33.1), Keymap/K34 (SW2_K34.1), Keymap/K35 (SW2_K35.1), Keymap/K36 (SW2_K36.1)
Row4: Sheet1 (U1.27), Keymap/K37 (SW2_K37.1), Keymap/K38 (SW2_K38.1), Keymap/K39 (SW2_K39.1), Keymap/K40 (SW2_K40.1), Keymap/K41 (SW2_K41.1), Keymap/K42 (SW2_K42.1), Keymap/K43 (SW2_K43.1), Keymap/K44 (SW2_K44.1), Keymap/K45 (SW2_K45.1), Keymap/K46 (SW2_K46.1), Keymap/K47 (SW2_K47.1), Keymap/K48 (SW2_K48.1)
Row5: Sheet1 (U1.28), Keymap/K49 (SW2_K49.1), Keymap/K50 (SW2_K50.1), Keymap/K51 (SW2_K51.1), Keymap/K52 (SW2_K52.1), Keymap/K53 (SW2_K53.1), Keymap/K54 (SW2_K54.1), Keymap/K55 (SW2_K55.1), Keymap/K56 (SW2_K56.1), Keymap/K57 (SW2_K57.1), Keymap/K58 (SW2_K58.1), Keymap/K59 (SW2_K59.1), Keymap/K60 (SW2_K60.1)